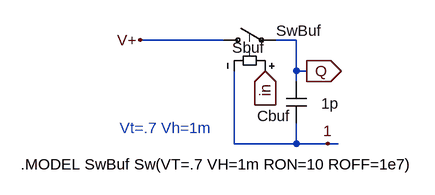
[diagram p0: schematic SwBuf.asc]
SwBuf.asc, the LTspice schematic file:
Version 4
SHEET 1 880 680
WIRE 0 176 -128 176
WIRE 16 336 16 224
WIRE 112 176 80 176
WIRE 112 224 112 176
WIRE 112 240 112 224
WIRE 112 336 16 336
WIRE 112 336 112 304
WIRE 128 224 112 224
WIRE 160 336 112 336
WIRE 176 336 160 336
FLAG 128 224 Q
IOPIN 128 224 Out
FLAG 64 224 in
IOPIN 64 224 In
FLAG 160 336 1
FLAG -128 176 V+
SYMBOL sw -16 176 R270
WINDOW 0 -12 29 VRight 0
WINDOW 3 14 97 VRight 0
SYMATTR InstName Sbuf
SYMATTR Value SwBuf
SYMBOL cap 128 240 M0
WINDOW 0 25 53 Left 0
WINDOW 3 -49 34 Left 0
WINDOW 39 -97 57 Left 0
SYMATTR InstName Cbuf
SYMATTR Value 1p
TEXT -312 368 Left 0 !.MODEL SwBuf Sw(VT=.7 VH=1m RON=10 ROFF=1e7)
TEXT -160 312 Left 0 ;Vt=.7 Vh=1m

The netlist it stands for:
* SwBuf.asc
Sbuf V+ Q in 1 SwBuf
Cbuf Q 1 1p
.MODEL SwBuf Sw(VT=.7 VH=1m RON=10 ROFF=1e7)
* Vt=.7 Vh=1m
.backanno
.end